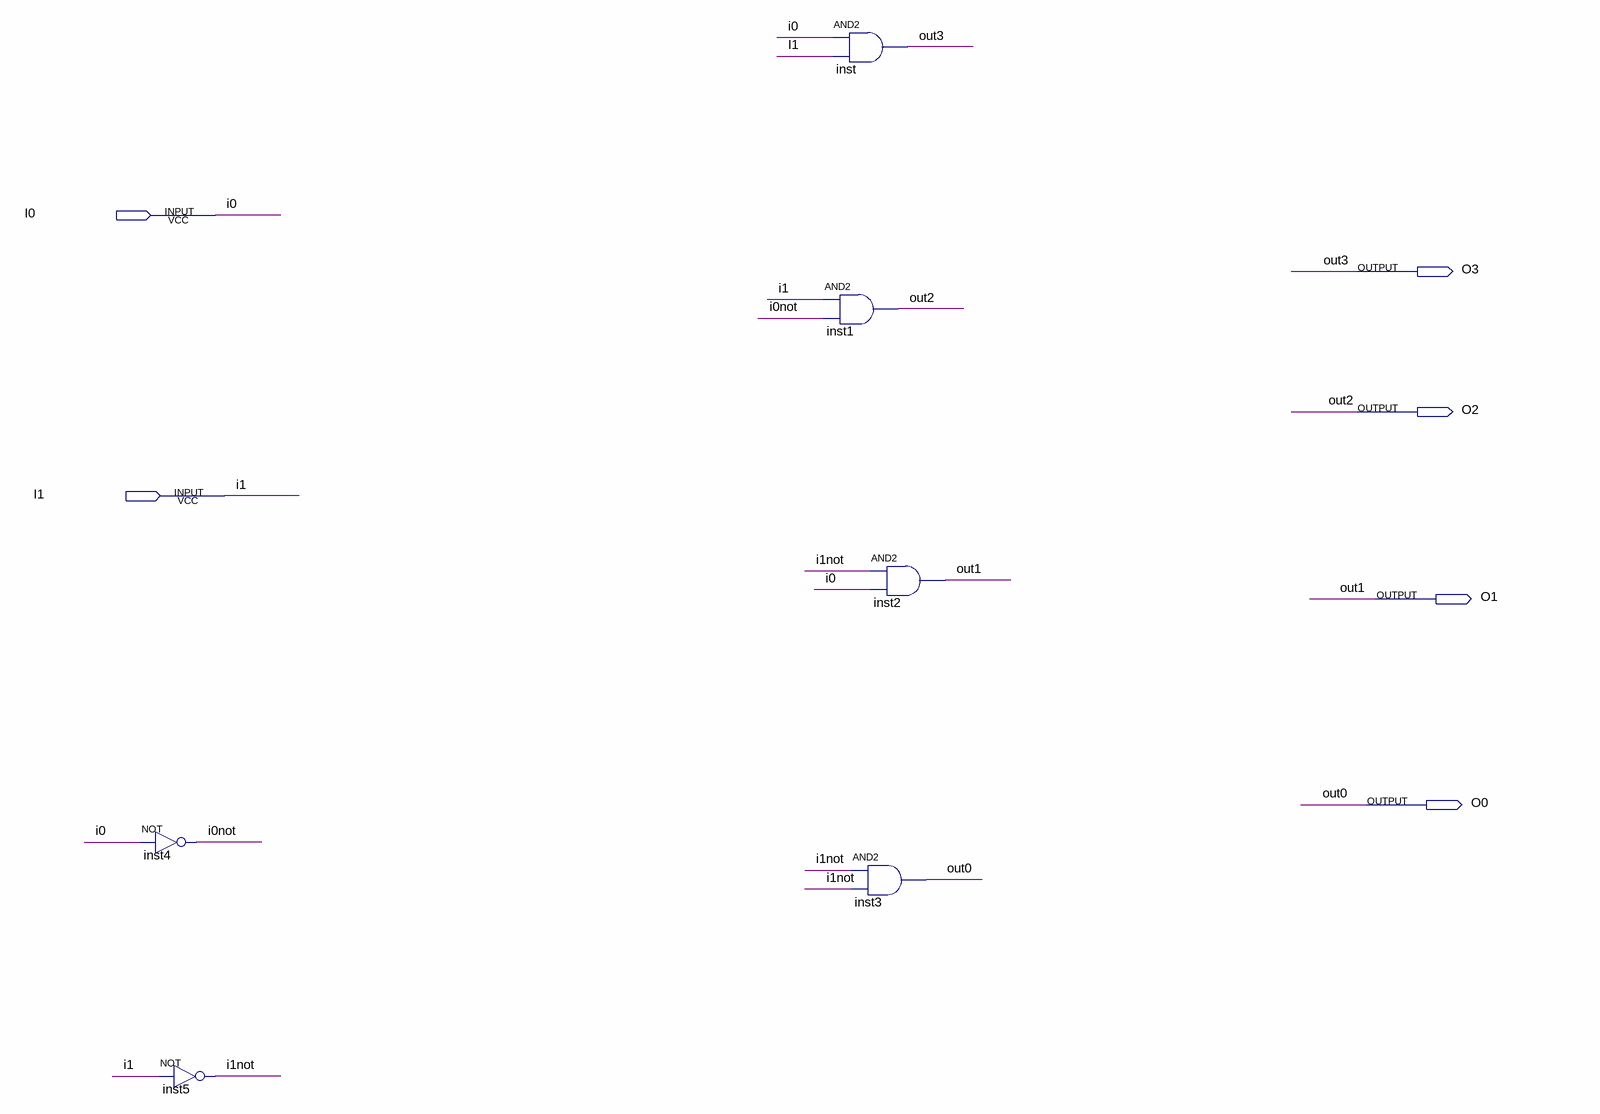
[diagram p0: schematic sheet]
// Quartus schematic decoder2_4.bdf as structural Verilog: 6 symbols, 6 pins
module decoder2_4 (
  input  I0,
  input  I1,
  output O3,
  output O2,
  output O1,
  output O0
);

  wire i0not, i1not;

  not inst4 (i0not, I0);
  not inst5 (i1not, I1);
  and inst (O3, I0, I1);
  and inst1 (O2, I1, i0not);
  and inst2 (O1, i1not, I0);
  and inst3 (O0, i1not, i1not);

  // Other names for the same wires on the sheet: out0 = O0; out1 = O1; out2 = O2; out3 = O3
endmodule
